# Altium schematic sheet Ultrasonic_Receiver.SchDoc: Ultrasonic Receiver
size A4; Author: Álvaro Hernando; CompanyName: bq - Mundo Reader; Organization: bq - Mundo Reader; DocumentNumber: 1; Revision: 1.0; SheetNumber: 3; SheetTotal: 3; ProjectName: ZOWI_Ultrasonic
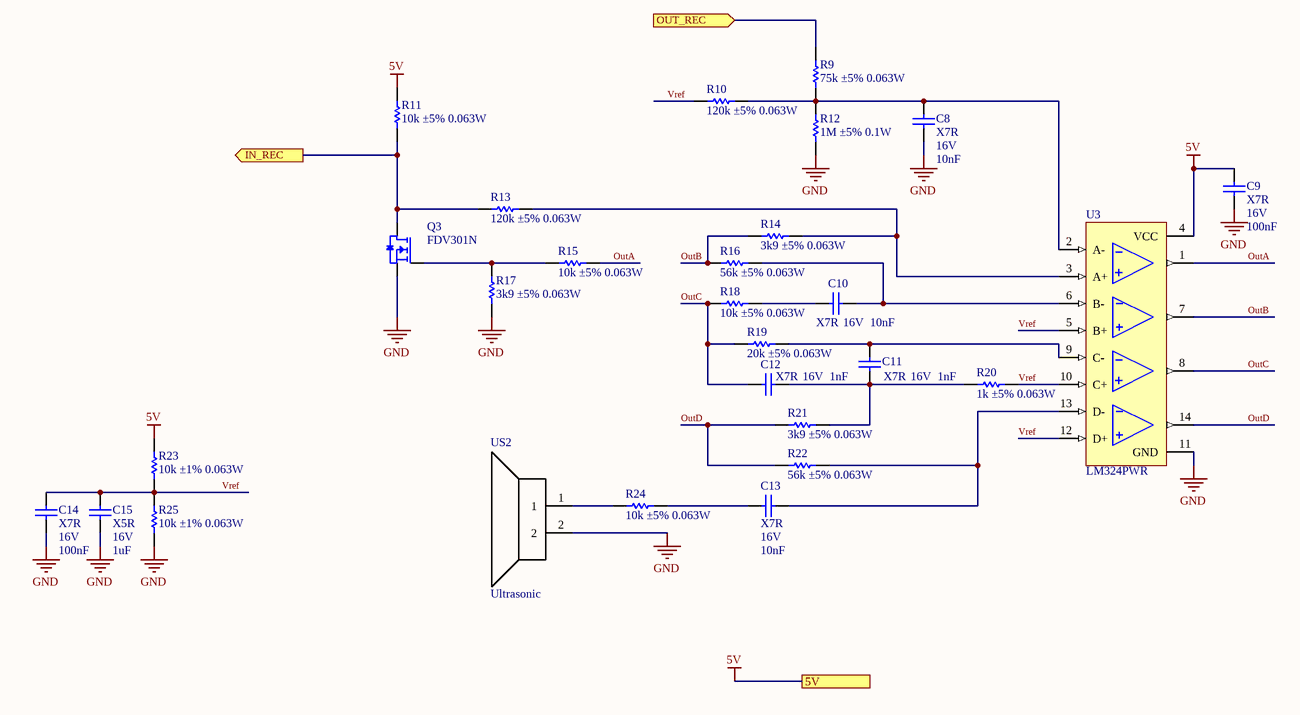
[diagram p0: Ultrasonic_Receiver.SchDoc]

## Parts
C8  Dielectric: X7R  Voltage: 16V  Capacitance: 10nF  [C0402]  (hidden comment: Capacitor)
C9  Dielectric: X7R  Voltage: 16V  Capacitance: 100nF  [C0402]  (hidden comment: Capacitor)
C10  Dielectric: X7R  Voltage: 16V  Capacitance: 10nF  [C0402]  (hidden comment: Capacitor)
C11  Dielectric: X7R  Voltage: 16V  Capacitance: 1nF  [C0402]  (hidden comment: Capacitor)
C12  Dielectric: X7R  Voltage: 16V  Capacitance: 1nF  [C0402]  (hidden comment: Capacitor)
C13  Dielectric: X7R  Voltage: 16V  Capacitance: 10nF  [C0402]  (hidden comment: Capacitor)
C14  Dielectric: X7R  Voltage: 16V  Capacitance: 100nF  [C0402]  (hidden comment: Capacitor)
C15  Dielectric: X5R  Voltage: 16V  Capacitance: 1uF  [C0603]  (hidden comment: Capacitor)
Q3  FDV301N  [SOT23-3]
R9  value 75k ±5% 0.063W  [R0402]  (hidden comment: Resistor)
R10  value 120k ±5% 0.063W  [R0402]  (hidden comment: Resistor)
R11  value 10k ±5% 0.063W  [R0402]  (hidden comment: Resistor)
R12  value 1M ±5% 0.1W  [R0603]  (hidden comment: Resistor)
R13  value 120k ±5% 0.063W  [R0402]  (hidden comment: Resistor)
R14  value 3k9 ±5% 0.063W  [R0402]  (hidden comment: Resistor)
R15  value 10k ±5% 0.063W  [R0402]  (hidden comment: Resistor)
R16  value 56k ±5% 0.063W  [R0402]  (hidden comment: Resistor)
R17  value 3k9 ±5% 0.063W  [R0402]  (hidden comment: Resistor)
R18  value 10k ±5% 0.063W  [R0402]  (hidden comment: Resistor)
R19  value 20k ±5% 0.063W  [R0402]  (hidden comment: Resistor)
R20  value 1k ±5% 0.063W  [R0402]  (hidden comment: Resistor)
R21  value 3k9 ±5% 0.063W  [R0402]  (hidden comment: Resistor)
R22  value 56k ±5% 0.063W  [R0402]  (hidden comment: Resistor)
R23  value 10k ±1% 0.063W  [R0402]  (hidden comment: Resistor)
R24  value 10k ±5% 0.063W  [R0402]  (hidden comment: Resistor)
R25  value 10k ±1% 0.063W  [R0402]  (hidden comment: Resistor)
U3  LM324PWR  [TSSOP14]
US2  Ultrasonic  [NU40C16]

## Ports
5V, IN_REC (out), OUT_REC (in)

## Nets
5V: C9.2 R11.2 R23.2 U3.4(VCC) ; port 5V
GND: C8.1 C9.1 C14.1 C15.1 Q3.2(S) R12.1 R17.1 R25.1 U3.11(GND) US2.2
IN_REC: Q3.3(D) R11.1 R13.1 ; port IN_REC
OUT_REC: R9.2 ; port OUT_REC
OutA: R15.1 U3.1(OutA)
OutB: R14.1 R16.1 U3.7(OutB)
OutC: C12.1 R18.2 R19.1 U3.8(OutC)
OutD: R21.1 R22.1 U3.14(OutD)
Vref: C14.2 C15.2 R10.1 R20.2 R23.1 R25.2 U3.5(B+) U3.10(C+) U3.12(D+)
NetC8_2: C8.2 R9.1 R10.2 R12.2 U3.2(A-)
NetC10_1: C10.1 R16.2 U3.6(B-)
NetC10_2: C10.2 R18.1
NetC11_1: C11.1 C12.2 R20.1 R21.2
NetC11_2: C11.2 R19.2 U3.9(C-)
NetC13_1: C13.1 R22.2 U3.13(D-)
NetC13_2: C13.2 R24.1
NetQ3_1: Q3.1(G) R15.2 R17.2
NetR13_2: R13.2 R14.2 U3.3(A+)
NetR24_2: R24.2 US2.1

## Notes on the sheet
- Title
- Project
- Size:
- Author
- A4
- Number:
- Revision:
- Mundo Reader, S.L. This project and all the sheets and layouts enclosed are licensed under Creative Commons by Attribution and Share Alike [CC BY-SA] (www.creativecommons.com)
- Date:
- Time:
- Sheet
- of

## Library data of the parts
C8 C10 C13 = C0402_10nF_16V_±10%: Capacitor SMD; Manufacturer: Kemet; Value: 10nF ±10% 16V; Tolerance: ±10%; OrderingCode: C0402C103K4RAC; Temp_ Max: 125; Temp_ Min: -55; Part Number: C0402_10nF_16V_±10%
C9 C14 = C0402_100nF_16V_±10%: Capacitor SMD; Manufacturer: Kemet; Value: 100nF ±10% 16V; Tolerance: ±10%; OrderingCode: C0402C104K4RAC; Temp_ Max: 125; Temp_ Min: -55; Part Number: C0402_100nF_16V_±10%
C11 C12 = C0402_1nF_16V_±10%: Capacitor SMD; Manufacturer: Kemet; Value: 1nF ±10% 16V; Tolerance: ±10%; OrderingCode: C0402C102K4RAC; Temp_ Max: 125; Temp_ Min: -55; Part Number: C0402_1nF_16V_±10%
C15 = C0603_1uF_16V_±10%: Capacitor SMD; Manufacturer: Kemet; Value: 1uF ±10% 16V; Tolerance: ±10%; OrderingCode: C0603C105K4PAC; Temp_ Max: 125; Temp_ Min: -55; Part Number: C0603_1uF_16V_±10%
Q3 = FDV301N: NFET; Manufacturer: Fairchild Semiconductor; Vds: 25V; Vgss: 8V; Id: 0,22A; Temp_ Max: 150; Temp_ Min: -55; OrderingCode 2: DMG301NU-13; Part Number: FDV301N; OrderingCode: FDV301N; Manufacturer 2: Diode
R9 = R0402_75k_0.063W_±5%: Resistor, SMD; Manufacturer: Vishay; Tolerance: ±5%; OrderingCode: CRCW040275K0JN; Power: 0.063W; Resistance: 75k; Temp_ Max: 155; Temp_ Min: -55; PackageDescription: SMD; Part Number: R0402_75k_0.063W_±5%
R10 R13 = R0402_120k_0.063W_±5%: Resistor, SMD; Manufacturer: Vishay; Tolerance: ±5%; OrderingCode: CRCW0402120KJN; Power: 0.063W; Resistance: 120k; Temp_ Max: 155; Temp_ Min: -55; PackageDescription: SMD; Part Number: R0402_120k_0.063W_±5%
R11 R15 R18 R24 = R0402_10k_0.063W_±5%: Resistor, SMD; Manufacturer: Vishay; Tolerance: ±5%; OrderingCode: CRCW040210K0JN; Power: 0.063W; Resistance: 10k; Temp_ Max: 155; Temp_ Min: -55; PackageDescription: SMD; Part Number: R0402_10k_0.063W_±5%
R12 = R0603_1M_0.1W_±5%: Resistor, SMD; Manufacturer: Vishay; Tolerance: ±5%; OrderingCode: CRCW06031M00JN; Power: 0.1W; Resistance: 1M; Temp_ Max: 155; Temp_ Min: -55; PackageDescription: SMD; Part Number: R0603_1M_0.1W_±5%
R14 R17 R21 = R0402_3k9_0.063W_±5%: Resistor, SMD; Manufacturer: Vishay; Tolerance: ±5%; OrderingCode: CRCW04023K90JN; Power: 0.063W; Resistance: 3k9; Temp_ Max: 155; Temp_ Min: -55; PackageDescription: SMD; Part Number: R0402_3k9_0.063W_±5%
R16 R22 = R0402_56k_0.063W_±5%: Resistor, SMD; Manufacturer: Vishay; Tolerance: ±5%; OrderingCode: CRCW040256K0JN; Power: 0.063W; Resistance: 56k; Temp_ Max: 155; Temp_ Min: -55; PackageDescription: SMD; Part Number: R0402_56k_0.063W_±5%
R19 = R0402_20k_0.063W_±5%: Resistor, SMD; Manufacturer: Vishay; Tolerance: ±5%; OrderingCode: CRCW040220K0JN; Power: 0.063W; Resistance: 20k; Temp_ Max: 155; Temp_ Min: -55; PackageDescription: SMD; Part Number: R0402_20k_0.063W_±5%
R20 = R0402_1k_0.063W_±5%: Resistor, SMD; Manufacturer: Vishay; Tolerance: ±5%; OrderingCode: CRCW04021K00JN; Power: 0.063W; Resistance: 1k; Temp_ Max: 155; Temp_ Min: -55; PackageDescription: SMD; Part Number: R0402_1k_0.063W_±5%
R23 R25 = R0402_10k_0.063W_±1%: Resistor, SMD; Manufacturer: Vishay; Tolerance: ±1%; OrderingCode: CRCW040210K0FK; Power: 0.063W; Resistance: 10k; Temp_ Max: 155; Temp_ Min: -55; PackageDescription: SMD; Part Number: R0402_10k_0.063W_±1%
U3 = LM324PWR: Operational Amplifier Quadruple; Manufacturer: Texas Instruments; Vdc: 3 - 32 V; Temp_ Max: 70; Temp_ Min: 0; Part Number: LM324PWR; OrderingCode: LM324PWR
US2 = NU40C16R-2: Ultrasonic Sensor; Manufacturer: Jinci; Temp_ Max: 70; Temp_ Min: -20; Part Number: NU40C16R-2; OrderingCode: NU40C16R-2